# EAGLE design mkwatch_btm (EAGLE 9.6.1)
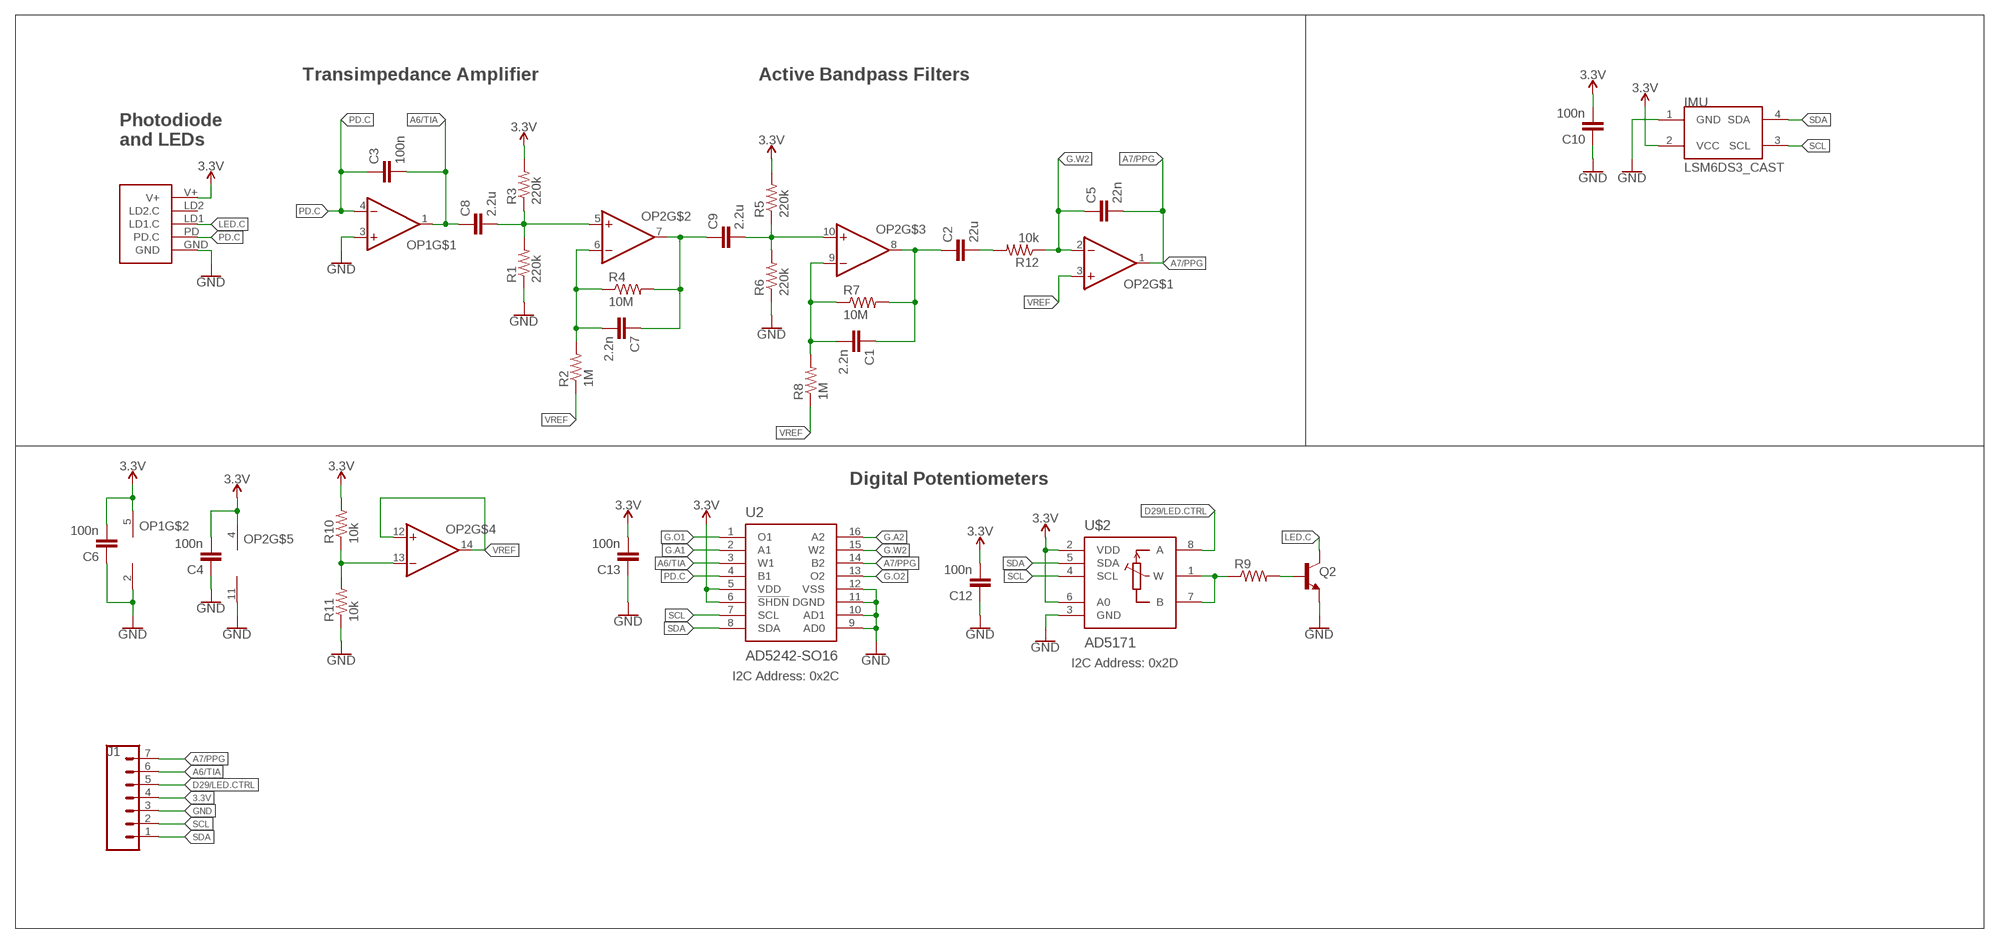
[diagram p0: schematic, sheet 1]

## Parts
C1  2.2n  CAPACITOR0603  [C0603]
C2  22u  CAPACITOR0603  [C0603]
C3  100n  CAPACITOR0603  [C0603]
C4  100n  CAPACITOR0603  [C0603]
C5  22n  CAPACITOR0603  [C0603]
C6  100n  CAPACITOR0603  [C0603]
C7  2.2n  CAPACITOR0603  [C0603]
C8  2.2u  CAPACITOR0603  [C0603]
C9  2.2u  CAPACITOR0603  [C0603]
C10  100n  CAPACITOR0603  [C0603]
C12  100n  CAPACITOR0603  [C0603]
C13  100n  CAPACITOR0603  [C0603]
IMU  LSM6DS3_CAST  [LSM6DS3_CAST]
J1  CONN_07-1.27MM  [1X07_1.27MM]
OP1  OP-SINGLEOT  [SOT23-5]
OP2  OP-QUAD-SO14  [SO14]
Q2  NPN-GENERIC  [SOT23-3]
R1  220k  RESISTOR0603  [R0603]
R2  1M  RESISTOR0603  [R0603]
R3  220k  RESISTOR0603  [R0603]
R4  10M  RESISTOR0603  [R0603]
R5  220k  RESISTOR0603  [R0603]
R6  220k  RESISTOR0603  [R0603]
R7  10M  RESISTOR0603  [R0603]
R8  1M  RESISTOR0603  [R0603]
R9  RESISTOR0603  [R0603]
R10  10k  RESISTOR0402  [R0402]
R11  10k  RESISTOR0402  [R0402]
R12  10k  RESISTOR0603  [R0603]
U2  AD5242-SO16  [SO16]
U$1  PPG.MODULE.2  [PPG.MODULE.2]
U$2  AD5171  [SOT-23-8]

## Nets
3.3V: C4.2 C6.2 C10.2 C12.2 C13.2 IMU.2(VCC) J1.4 OP1.5(V+) OP2.4(V+) R3.2 R5.2 R10.2 U2.5(VDD) U2.6(!SHDN) U$1.V+ U$2.2(VDD) U$2.6(A0)
A6/TIA: C3.2 C8.1 J1.6 OP1.1(OUT) U2.3(W1)
A7/PPG: C5.2 J1.7 OP2.1(OUT) U2.14(B2)
D29/LED.CTRL: J1.5 U$2.8(A)
G.A1: U2.2(A1)
G.A2: U2.16(A2)
G.O1: U2.1(O1)
G.O2: U2.13(O2)
G.W2: C5.1 OP2.2(-IN) R12.1 U2.15(W2)
GND: C4.1 C6.1 C10.1 C12.1 C13.1 IMU.1(GND) J1.3 OP1.2(V-) OP1.3(+IN) OP2.11(V-) Q2.2(E) R1.1 R6.1 R11.1 U2.9(AD0) U2.10(AD1) U2.11(DGND) U2.12(VSS) U$1.GND U$2.3(GND)
LED.C: Q2.3(C) U$1.LD1(LD1.C)
N$1: C8.2 OP2.5(+IN) R1.2 R3.1
N$2: C9.2 OP2.10(+IN) R5.1 R6.2
N$3: C7.2 OP2.6(-IN) R2.2 R4.1
N$4: C7.1 C9.1 OP2.7(OUT) R4.2
N$5: C1.2 OP2.9(-IN) R7.1 R8.2
N$6: C1.1 C2.1 OP2.8(OUT) R7.2
N$7: C2.2 R12.2
N$11: Q2.1(B) R9.2
N$12: R9.1 U$2.1(W) U$2.7(B)
N$14: OP2.13(-IN) R10.1 R11.2
PD.C: C3.1 OP1.4(-IN) U2.4(B1) U$1.PD(PD.C)
SCL: IMU.3(SCL) J1.2 U2.7(SCL) U$2.4(SCL)
SDA: IMU.4(SDA) J1.1 U2.8(SDA) U$2.5(SDA)
VREF: OP2.3(+IN) OP2.12(+IN) OP2.14(OUT) R2.1 R8.1
Unconnected: U$1.LD2(LD2.C)

## Notes on the sheet
- Transimpedance Amplifier | Active Bandpass Filters
- Photodiode
  and LEDs
- Digital Potentiometers
- I2C Address: 0x2D
- I2C Address: 0x2C

## Library data of the parts
C1-C10 C12 C13 = LinnesLab-Passives:CAPACITOR
IMU = LinnesLab-Sensors:LSM6DS3_CAST
J1 = LinnesLab-Connectors:CONN_07: Multi connection point. Often used as Generic Header-pin footprint for 0.1 inch spaced/style header connections On any of the 0.1 inch spaced packages, you can populate with these: Break Away Headers - Straight <https://www.sparkfun.com/products/116> (PRT-00116) Break Away Male Headers - Right Angle <https://www.sparkfun.com/products/553> (PRT-00553) Female Headers <https://www.sparkfun.com/products/115> (PRT-00115) Break Away Headers - Machine Pin <https://www.sparkfun.com/products/117> (PRT-00117) Break Away Female Headers - Swiss Machine Pin <https://www.sparkfun.com/products/743> (PRT-00743) For SCREWTERMINALS and SPRING TERMINALS visit here: Screw Terimnals on SparkFun.com <https://www.sparkfun.com/search/results?term=Screw+Terminals> (5mm/3.5mm/2.54mm spacing) This device is also useful as a general connection point to wire up your design to another part of your project. Our various solder wires solder well into these plated through hole pads. Hook-Up Wire - Assortment (Stranded, 22 AWG) <https://www.sparkfun.com/products/11375> (PRT-11375) Hook-Up Wire - Assortment (Solid Core, 22 AWG) <https://www.sparkfun.com/products/11367> (PRT-11367) View the entire wire category on our website here <https://www.sparkfun.com/categories/141> Special notes: Molex polarized connector foot print use with SKU : PRT-08231 with associated crimp pins and housings. 1MM SMD Version SKU: PRT-10208 NOTES ON THE VARIANTS LOCK and LOCK_LONGPADS... This footprint was designed to help hold the alignment of a through-hole component (i.e. 6-pin header) while soldering it into place. You may notice that each hole has been shifted either up or down by 0.005 of an inch from it's more standard position (which is a perfectly straight line). This slight alteration caused the pins (the squares in the middle) to touch the edges of the holes. Because they are alternating, it causes a "brace" to hold the component in place. 0.005 has proven to be the perfect amount of "off-center" position when using our standard breakaway headers. Although looks a little odd when you look at the bare footprint, once you have a header in there, the alteration is very hard to notice. Also,if you push a header all the way into place, it is covered up entirely on the bottom side.
OP1 = LinnesLab-AnalogIC:OP-SINGLE: Single Op Amp 2.7V to 6.0V Single Supply CMOS Source: http://ww1.microchip.com/downloads/en/DeviceDoc/21314g.pdf
OP2 = LinnesLab-AnalogIC:OP-QUAD: General symbol and footprints for Quad Op Amps. Use with any standard general purpose op amp.
Q2 = LinnesLab-DiscreteSemi:NPN
R1-R12 = LinnesLab-Passives:RESISTOR
U2 = LinnesLab-DigitalIC:AD5242
U$1 = LinnesLab-Connectors:PPG.MODULE.2: Digi-Key Part Number: S9014E-50-ND Manufacturer Part Number: GRPB501VWVN-RC Description: 1mm insulation height 0.05in pitch 50 positions
U$2 = LinnesLab-DigitalIC:AD5171

## Board
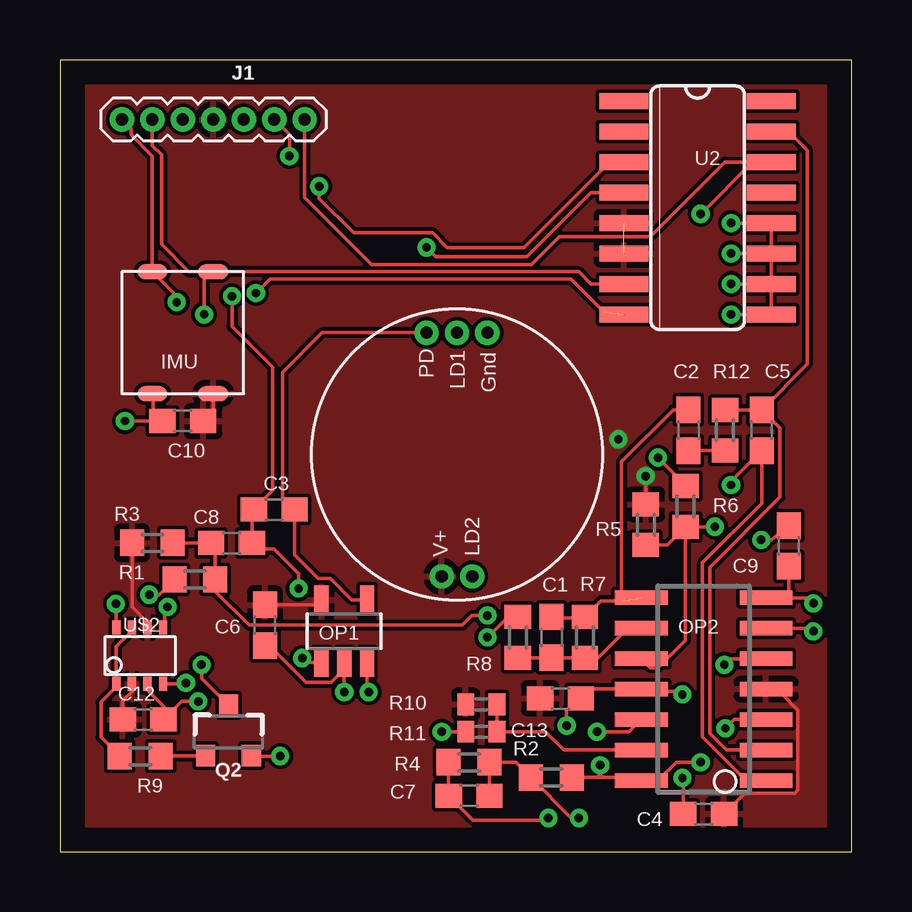
[diagram p1: board, top side]
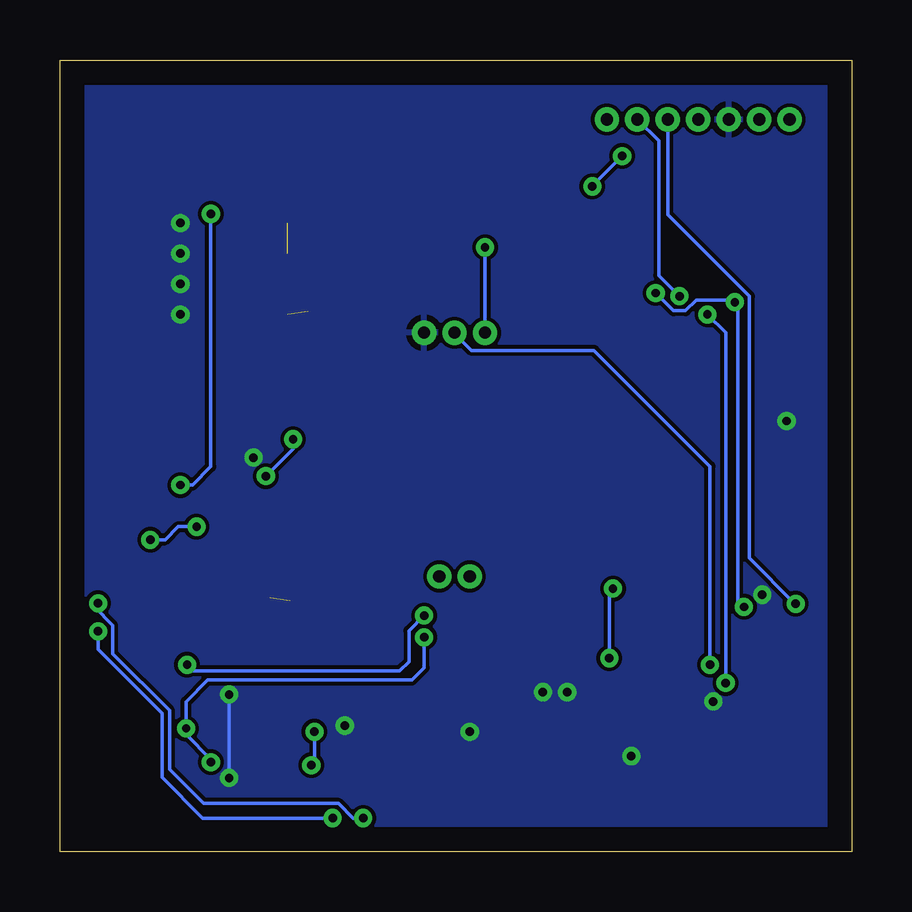
[diagram p2: board, bottom side, seen from below]

Size 33 x 33 mm. Coordinates in mm from the lower left corner, seen from the top.
Outline: 0,0 33,0 33,33 0,33 0,0
Copper layers (1*16): Top 0.035mm / dielectric 1.5mm / Bottom 0.035mm
Design rules "default": minimum track width 6mil, minimum drill 0.35mm, track to track 6mil, track to pad 6mil, pad to pad 6mil, via to via 6mil, smd to smd 6mil, copper to edge 40mil, drill to drill 6mil, minimum pad ring 10mil, minimum via ring 8mil, stop-mask expansion 4mil, vias tented up to drill 0mil, thermal gap 10mil

### Footprints (pad centres in the part's own frame; a part is rotated, then mirrored left to right if it is on the bottom)
C0603 = smd 1.1 x 1: 1 -0.85,0; 2 0.85,0
LSM6DS3_CAST = smd 0.635 x 1.27: 1 -2.54,1.27; 2 -2.54,-1.27; 3 2.54,-1.27; 4 2.54,1.27
1X07_1.27MM = drill 0.508 pad 1: 1 0,0; 2 1.27,0; 3 2.54,0; 4 3.81,0; 5 5.08,0; 6 6.35,0; 7 7.62,0
SOT23-5 = smd 0.6 x 1.2: 1 -0.95,-1.306; 2 0,-1.306; 3 0.95,-1.306; 4 0.95,1.306; 5 -0.95,1.306
SO14 = smd 0.6 x 2.2: 1 -3.81,-2.6; 2 -2.54,-2.6; 3 -1.27,-2.6; 4 0,-2.6; 5 1.27,-2.6; 6 2.54,-2.6; 7 3.81,-2.6; 8 3.81,2.6; 9 2.54,2.6; 10 1.27,2.6; 11 0,2.6; 12 -1.27,2.6; 13 -2.54,2.6; 14 -3.81,2.6
SOT23-3 = smd 0.8 x 0.9: 1 -0.95,-1; 2 0.95,-1; 3 0,1.1
R0603 = smd 1 x 1.1: 1 -0.85,0; 2 0.85,0
R0402 = smd 0.7 x 0.9: 1 -0.65,0; 2 0.65,0
SO16 = smd 0.66 x 2.032: 1 -4.445,-3.073; 2 -3.175,-3.073; 3 -1.905,-3.073; 4 -0.635,-3.073; 5 0.635,-3.073; 6 1.905,-3.073; 7 3.175,-3.073; 8 4.445,-3.073; 9 4.445,3.073; 10 3.175,3.073; 11 1.905,3.073; 12 0.635,3.073; 13 -0.635,3.073; 14 -1.905,3.073; 15 -3.175,3.073; 16 -4.445,3.073
PPG.MODULE.2 = drill 0.508 pad 0.94: GND 1.27,5.08; LD1 0,5.08; LD2 0.635,-5.08; PD -1.27,5.08; V+ -0.635,-5.08
SOT-23-8 = smd 0.35 x 0.6: 1 -0.991,-1.176; 2 -0.341,-1.176; 3 0.309,-1.176; 4 0.959,-1.176; 5 0.959,1.176; 6 0.309,1.176; 7 -0.341,1.176; 8 -0.991,1.176

### Placement (x,y rotation side)
C1  20.49,8.93 270 top
C2  26.2,17.57 270 top
C3  8.93,14.26 180 top
C4  26.84,1.56 0 top
C5  29.25,17.57 270 top
C6  8.55,9.44 90 top
C7  17.06,2.33 0 top
C8  7.15,12.87 180 top
C9  30.39,12.74 90 top
C10  5.12,17.95 0 top
C12  3.47,5.5 180 top
C13  20.87,6.39 180 top
IMU  5.12,21.63 90 top
J1  2.58,30.52 0 top
OP1  11.85,9.18 0 top
OP2  26.84,6.77 90 top
Q2  7.03,4.99 0 top
R1  5.63,11.34 0 top
R2  20.49,3.09 180 top
R3  3.85,12.87 180 top
R4  17.06,3.72 180 top
R5  24.42,13.63 90 top
R6  26.07,14.39 270 top
R7  21.88,8.93 90 top
R8  19.09,8.93 270 top
R9  3.34,3.98 0 top
R10  17.57,6.14 180 top
R11  17.57,4.99 0 top
R12  27.73,17.57 270 top
U2  26.58,26.84 270 top
U$1  16.55,16.55 0 top
U$2  3.34,8.17 0 top

### Tracks (layer width: path | path; a pad name or v marks a point on that pad's centre or on a via)
3.3V  (via drill 0.35)  (1 unrouted)
  Top 0.152: IMU.2 6.39,18.37 C10.2 | U$2.6 3.65,9.54 3,10.19 R3.2 | U$2.2 3,6.68 2.62,6.3 C12.2 | 10.84,10.49 OP1.5 10.7,10.29 C6.2 8.55,10.46 | C4.2 28.55,2.43 30.63,2.43 30.77,2.57 30.77,5.9 30.14,6.52 30.14,6.64 | R5.2 v24.42,15.65
  Bottom 0.152: v24.42,15.65 23.28,16.79 v23.28,17.18
  pour Top: -1.23,34.33 -1.23,0.04 0.04,-1.23 34.33,-1.23 34.33,33.06 33.06,34.33
A6/TIA  (via drill 0.35)
  Top 0.152: v7.18,23.15 7.18,21.88 8.86,20.2 8.86,15.04 C3.2 8,14.19 8,12.91 | J1.6 9.56,29.88 v9.56,29 | v10.81,27.73 10.81,27.22 12.23,25.79 15.53,25.79 16.14,25.19 19.34,25.19 22.9,28.74 U2.3 | OP1.1 10.24,7.88 10.07,8.04 v10.1,8.06 | 8,12.91 C8.1 8.26,12.61 8.93,12.61 9.95,11.6 v9.95,10.96 | 8.23,12.68 8,12.91
  Bottom 0.152: J1.6 8.04,29.63 8.04,24.02 v7.18,23.15 | v9.56,29 10.81,27.75 v10.81,27.73 | v10.1,8.06 10.1,10.69 9.95,10.84 v9.95,10.96
A7/PPG  (via drill 0.35)
  Top 0.152: 30.39,28.74 U2.14 28.87,28.74 | OP2.1 29.42,2.94 28.62,2.94 26.79,4.78 26.79,12.04 29.25,14.5 C5.2 27.98,15.45 v27.98,15.28 | 28.87,28.74 27.72,28.74 24.62,25.64 20.82,25.64 19.65,24.48 12.99,24.48 10.2,27.27 J1.7 | v26.71,26.58 28.87,28.74
  Bottom 0.152: v27.98,15.28 27.47,15.28 26.71,16.04 v26.71,26.58
D29/LED.CTRL  (via drill 0.35)
  Top 0.152: v2.33,10.33 2.35,10.3 U$2.8
  Bottom 0.152: J1.5 7.66,26.55 4.26,23.15 4.26,12.23 2.35,10.33 v2.33,10.33
G.W2
  Top 0.152: C5.1 R12.1 | OP2.2 27.79,4.23 27.09,4.92 27.09,11.85 30.01,14.77 30.01,17.65 C5.1 | U2.15 30.39,30.01 31.16,29.25 31.16,20.32 C5.1
GND  (via drill 0.35)
  Top 0.152: IMU.1 3.89,19.05 3.89,18.33 C10.1 v2.71,17.95 | v9.18,3.98 7.99,3.98 Q2.2 | 11.85,7.61 OP1.2 11.85,7.91 | 11.85,7.61 v11.85,6.64 | OP1.3 12.8,6.71 v12.87,6.64 | R1.1 4.14,10.71 v3.72,10.71 | U$2.3 3.65,6.72 4.32,6.05 C12.1 5.07,6.26 v5.76,6.26 | v21.12,5.25 21.12,5.88 21.63,6.39 C13.1 21.72,6.41 22.08,6.77 OP2.11 24.34,6.67 25.82,6.67 v25.95,6.54 | C6.1 8.71,8.59 10.25,7.05 11.3,7.05 11.85,7.61 | v25.95,3.07 25.99,3.03 C4.1 | R11.1 v15.91,4.99 | U2.11 U2.12 v27.98,26.2 | U2.10 U2.11 | U2.10 U2.9 v27.98,22.39 | U2.11 v27.98,24.93 | U2.10 v27.98,23.66 | R6.1 26.07,15.28 v24.93,16.42
  Bottom 0.152: v25.95,6.54 v25.95,3.07
  pour Bottom: -1.23,35.6 -1.23,-1.23 34.33,-1.23 34.33,35.6
LED.C  (via drill 0.35)
  Top 0.152: Q2.3 5.9,7.22 v5.9,7.79
  Bottom 0.152: v5.9,7.79 5.9,16.06 10.73,20.89 15.84,20.89 16.55,21.6 U$1.LD1
N$1  (via drill 0.35)
  Top 0.152: OP2.5 27.95,8.04 v27.7,7.79 | 4.95,12.87 R3.1 C8.2 6.48,12.69 R1.2 6.48,10.84 7.88,9.44 16.78,9.44 17.18,9.84 v17.82,9.84
  Bottom 0.152: v17.82,9.84 18.45,9.2 18.45,7.91 18.84,7.53 27.45,7.53 v27.7,7.79
N$2  (via drill 0.35)
  Top 0.152: R6.2 25.31,12.78 R5.1 | OP2.10 24.62,7.66 24.93,7.66 26.07,8.8 R6.2 | v29.23,12.99 29.66,12.99 C9.2 | v27.3,13.54 26.92,13.54 R6.2
  Bottom 0.152: v29.23,12.99 28.61,12.99 28.07,13.54 v27.3,13.54
N$3  (via drill 0.35)
  Top 0.152: C7.2 R4.1 19,3.72 R2.2 21.33,1.39 v21.63,1.39 21.55,1.39 | OP2.6 31.41,9.31 v31.41,9.18
  Bottom 0.152: v31.41,9.18 31.41,8.42 28.74,5.76 28.74,3.09 27.05,1.39 v21.63,1.39
N$4  (via drill 0.35)
  Top 0.152: R4.2 C7.1 17.22,1.31 20.36,1.31 v20.36,1.39 | v31.41,10.35 31.17,10.58 30.39,10.58 | 30.39,10.58 OP2.7 | C9.1 30.39,10.58
  Bottom 0.152: v20.36,1.39 20.77,1.39 21.38,2 27.02,2 28.44,3.42 28.44,5.88 30.8,8.25 30.8,9.44 31.56,10.19 v31.41,10.35
N$5
  Top 0.152: OP2.9 23.66,9.31 23.41,9.06 | 23.41,9.06 23.35,9.06 | 19.22,7.95 R8.2 C1.2 R7.1 22.43,8.08 23.41,9.06
N$6  (1 unrouted)
  Top 0.152: OP2.8 23.41,10.58 23.41,16.26 25.57,18.42 C2.1 | 23.41,10.45 22.56,10.45 R7.2 21.85,9.75 20.49,9.75 C1.1
N$7
  Top 0.152: R12.2 C2.2
N$11
  Top 0.152: R9.2 4.21,3.99 Q2.1
N$12
  Top 0.152: R9.1 1.72,4.75 1.72,6.23 2.35,6.87 U$2.1 2.35,8.55 3,9.2 U$2.7
N$14
  Top 0.152: OP2.13 21.01,4.23 20.25,4.99 R11.2 R10.1
PD.C  (via drill 0.35)
  Top 0.152: OP1.4 12.17,10.49 11.28,11.38 10.76,11.38 9.78,12.36 C3.1 9.27,14.77 9.27,19.98 10.92,21.63 U$1.PD | U2.4 22.14,27.47 19.47,24.8 15.66,24.8 v15.28,25.19
  Bottom 0.152: v15.28,25.19 U$1.PD
SCL  (via drill 0.35)
  Top 0.152: U$2.4 5.21,6.99 v5.25,7.03 | U2.7 22.14,23.66 21.63,24.17 IMU.3 6.01,24.17 | 6.01,24.17 v6.01,22.39 | J1.2 3.85,29.43 4.23,29.05 4.23,25.31 5.37,24.17 6.01,24.17
  Bottom 0.152: v5.25,7.03 5.25,21.63 v6.01,22.39
SDA  (via drill 0.35)  (1 unrouted)
  Top 0.152: U$2.5 4.36,9.4 4.36,10.07 v4.49,10.2 | v4.87,22.9 4.87,23.15 IMU.4 3.85,29 2.96,29.88 2.96,30.14 J1.1 | v8.17,23.28 8.75,23.86 21.3,23.86 22.65,22.52
  Bottom 0.152: v4.49,10.2 4.74,10.45 4.74,22.77 v4.87,22.9 4.96,23 6.47,23 6.92,22.55 7.43,22.55 v8.16,23.28 v8.17,23.28
VREF  (via drill 0.35)
  Top 0.152: OP2.3 29.42,5.52 28.12,5.52 v27.74,5.13 | R8.1 18.67,9.78 v17.82,8.93 | v26.71,3.72 25.69,3.72 24.93,2.96 OP2.14 24.11,3.09 22.65,3.09 | OP2.12 23.73,4.99 v22.39,4.99 | 22.52,3.09 22.65,3.09 | 22.52,3.09 v22.52,3.6 22.52,3.21 | 22.52,3.09 22.39,3.09 | 22.39,3.09 R2.1 | 22.52,3.21 22.39,3.09 | 22.52,3.21 22.65,3.09
  Bottom 0.152: v26.71,3.72 26.71,3.85 27.74,4.88 v27.74,5.13 27.74,6.25 26.84,7.15 18.33,7.15 17.82,7.66 v17.82,8.93 | v22.39,4.99 22.39,3.72 v22.52,3.6